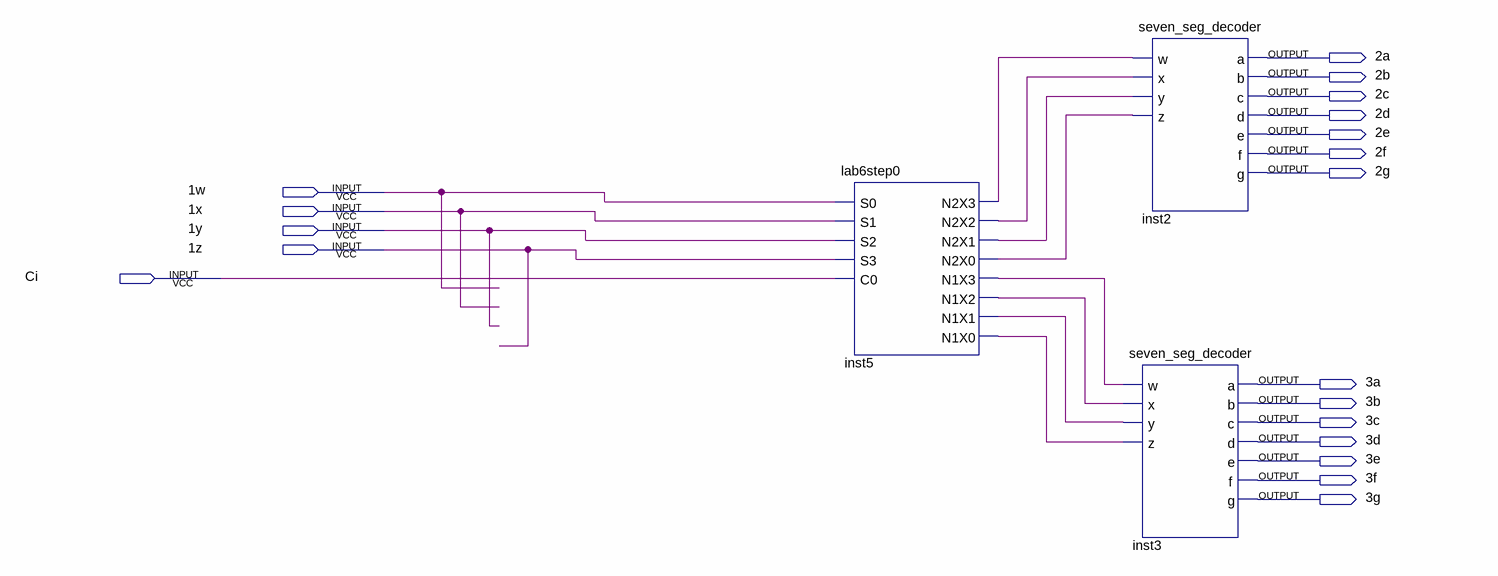
[diagram p0: schematic sheet]
// Quartus schematic lab6.bdf as structural Verilog: 3 symbols, 19 pins
module lab6 (
  input  \1w ,
  input  \1x ,
  input  \1y ,
  input  \1z ,
  input  Ci,
  output \2a ,
  output \2b ,
  output \2c ,
  output \2d ,
  output \2e ,
  output \2f ,
  output \2g ,
  output \3a ,
  output \3b ,
  output \3c ,
  output \3d ,
  output \3e ,
  output \3f ,
  output \3g 
);

  wire inst5_n1x0, inst5_n1x1, inst5_n1x2, inst5_n1x3, inst5_n2x0, inst5_n2x1, inst5_n2x2, inst5_n2x3;

  lab6step0 inst5 (
    .S0(\1w ), .S1(\1x ), .S2(\1y ), .S3(\1z ), .C0(Ci), .N2X3(inst5_n2x3), .N2X2(inst5_n2x2),
    .N2X1(inst5_n2x1), .N2X0(inst5_n2x0), .N1X3(inst5_n1x3), .N1X2(inst5_n1x2), .N1X1(inst5_n1x1),
    .N1X0(inst5_n1x0));
  seven_seg_decoder inst2 (
    .w(inst5_n2x3), .x(inst5_n2x2), .y(inst5_n2x1), .z(inst5_n2x0), .a(\2a ), .b(\2b ), .c(\2c ), .d(\2d ),
    .e(\2e ), .f(\2f ), .g(\2g ));
  seven_seg_decoder inst3 (
    .w(inst5_n1x3), .x(inst5_n1x2), .y(inst5_n1x1), .z(inst5_n1x0), .a(\3a ), .b(\3b ), .c(\3c ), .d(\3d ),
    .e(\3e ), .f(\3f ), .g(\3g ));
endmodule
